# Altium schematic sheet GD32E230C8T6核心板原理图.SchDoc
size A4
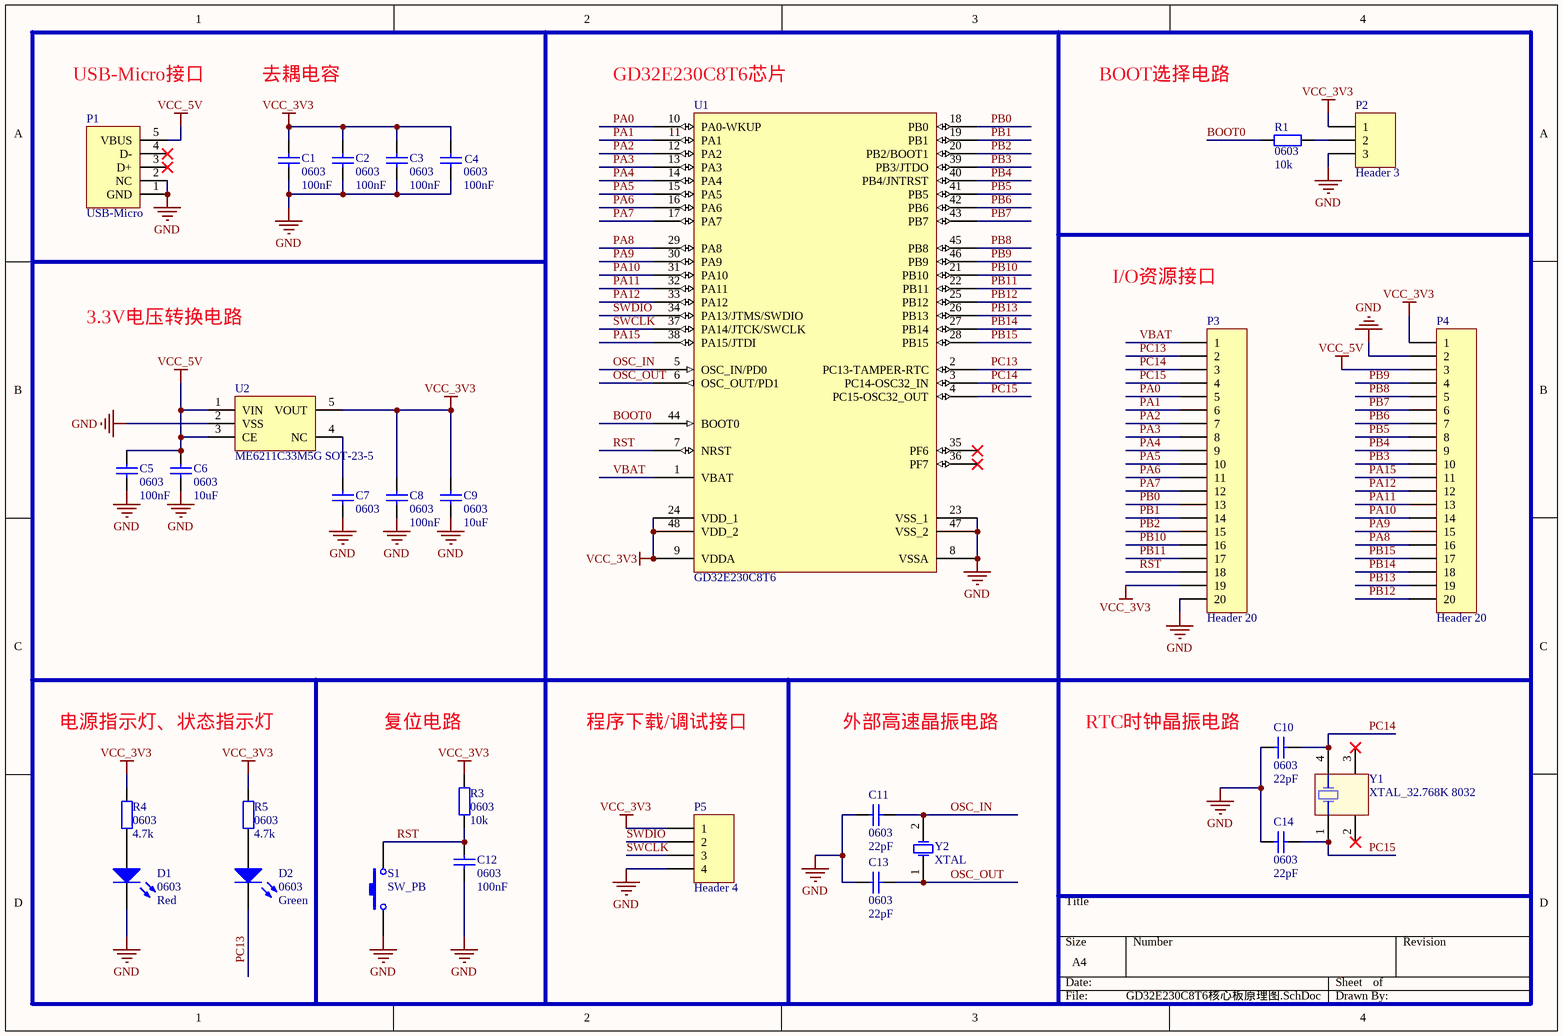
[diagram p0: GD32E230C8T6核心板原理图.SchDoc]

## Parts
C1  value 100nF  footprint: 0603  [R0603-R/C-Y]  (hidden comment: Cap 0603)
C2  value 100nF  footprint: 0603  [R0603-R/C-Y]  (hidden comment: Cap 0603)
C3  value 100nF  footprint: 0603  [R0603-R/C-Y]  (hidden comment: Cap 0603)
C4  value 100nF  footprint: 0603  [R0603-R/C-Y]  (hidden comment: Cap 0603)
C5  value 100nF  footprint: 0603  [R0603-R/C-Y]  (hidden comment: Cap 0603)
C6  value 10uF  footprint: 0603  [R0603-R/C-Y]  (hidden comment: Cap 0603)
C7  footprint: 0603  [R0603-R/C-Y]  (hidden comment: Cap 0603)
C8  value 100nF  footprint: 0603  [R0603-R/C-Y]  (hidden comment: Cap 0603)
C9  value 10uF  footprint: 0603  [R0603-R/C-Y]  (hidden comment: Cap 0603)
C10  value 22pF  footprint: 0603  [R0603-R/C-Y]  (hidden comment: Cap 0603)
C11  value 22pF  footprint: 0603  [R0603-R/C-Y]  (hidden comment: Cap 0603)
C12  value 100nF  footprint: 0603  [R0603-R/C-Y]  (hidden comment: Cap 0603)
C13  value 22pF  footprint: 0603  [R0603-R/C-Y]  (hidden comment: Cap 0603)
C14  value 22pF  footprint: 0603  [R0603-R/C-Y]  (hidden comment: Cap 0603)
D1  value Red  Footprint: 0603  [0603-LED-G]  (hidden comment: LED 0603)
D2  value Green  Footprint: 0603  [0603-LED-G]  (hidden comment: LED 0603)
P1  USB-Micro  [USB Micro]
P2  Header 3  [HDR1X3]
P3  Header 20  [HDR1X20]
P4  Header 20  [HDR1X20]
P5  Header 4  [HDR1X4]
R1  value 10k  Footprint: 0603  [R0603-R/C-BY]  (hidden comment: Res 0603)
R3  value 10k  Footprint: 0603  [R0603-R/C-BY]  (hidden comment: Res 0603)
R4  value 4.7k  Footprint: 0603  [R0603-R/C-BY]  (hidden comment: Res 0603)
R5  value 4.7k  Footprint: 0603  [R0603-R/C-BY]  (hidden comment: Res 0603)
S1  SW_PB  [SW-2Pin]
U1  GD32E230C8T6  [TQFP48_M]
U2  ME6211C33M5G SOT-23-5  [SOT-23-5]
Y1  XTAL_32.768K 8032  [XTAL_8032]
Y2  XTAL  [XTAL_49S]

## Nets
GND: C1.1 C2.1 C3.1 C4.1 C5.1 C6.1 C7.1 C8.1 C9.1 C10.2 C11.2 C12.1 C13.2 C14.2 D1.2(K) P1.1(GND) P1.2(NC) P2.3 P3.20 P4.2 P5.4 S1.1 U1.8(VSSA) U1.23(VSS_1) U1.47(VSS_2) U2.2(VSS)
VCC_3V3: C1.2 C2.2 C3.2 C4.2 C8.2 C9.2 P2.1 P3.19 P4.1 P5.1 R3.2 R4.1 R5.1 U1.9(VDDA) U1.24(VDD_1) U1.48(VDD_2) U2.5(VOUT)
VCC_5V: C5.2 C6.2 P1.5(VBUS) P4.3 U2.1(VIN) U2.3(CE)
BOOT0: R1.1 U1.44(BOOT0)
OSC_IN: C11.1 U1.5(OSC_IN/PD0) Y2.2(OSC2)
OSC_OUT: C13.1 U1.6(OSC_OUT/PD1) Y2.1(OSC1)
PA0: P3.5 U1.10(PA0-WKUP)
PA1: P3.6 U1.11(PA1)
PA2: P3.7 U1.12(PA2)
PA3: P3.8 U1.13(PA3)
PA4: P3.9 U1.14(PA4)
PA5: P3.10 U1.15(PA5)
PA6: P3.11 U1.16(PA6)
PA7: P3.12 U1.17(PA7)
PA8: P4.16 U1.29(PA8)
PA9: P4.15 U1.30(PA9)
PA10: P4.14 U1.31(PA10)
PA11: P4.13 U1.32(PA11)
PA12: P4.12 U1.33(PA12)
PA15: P4.11 U1.38(PA15/JTDI)
PB0: P3.13 U1.18(PB0)
PB1: P3.14 U1.19(PB1)
PB2: P3.15 U1.20(PB2/BOOT1)
PB3: P4.10 U1.39(PB3/JTDO)
PB4: P4.9 U1.40(PB4/JNTRST)
PB5: P4.8 U1.41(PB5)
PB6: P4.7 U1.42(PB6)
PB7: P4.6 U1.43(PB7)
PB8: P4.5 U1.45(PB8)
PB9: P4.4 U1.46(PB9)
PB10: P3.16 U1.21(PB10)
PB11: P3.17 U1.22(PB11)
PB12: P4.20 U1.25(PB12)
PB13: P4.19 U1.26(PB13)
PB14: P4.18 U1.27(PB14)
PB15: P4.17 U1.28(PB15)
PC13: D2.2(K) P3.2 U1.2(PC13-TAMPER-RTC)
PC14: C10.1 P3.3 U1.3(PC14-OSC32_IN) Y1.4(OSC2)
PC15: C14.1 P3.4 U1.4(PC15-OSC32_OUT) Y1.1(OSC1)
RST: C12.2 P3.18 R3.1 S1.2 U1.7(NRST)
SWCLK: P5.3 U1.37(PA14/JTCK/SWCLK)
SWDIO: P5.2 U1.34(PA13/JTMS/SWDIO)
VBAT: P3.1 U1.1(VBAT)
NetC7_2: C7.2 U2.4(NC)
NetD1_1: D1.1(A) R4.2
NetD2_1: D2.1(A) R5.2
NetP2_2: P2.2 R1.2

Not connected (* = marked no-connect by the designer): P1 3(D+)* 4(D-)*; U1 35(PF6)* 36(PF7)*; Y1 2(NC)* 3(NC)*

## Notes on the sheet
- USB-Micro接口
- 去耦电容
- (near U1) GD32E230C8T6芯片
- BOOT选择电路
- I/O资源接口
- 3.3V电压转换电路
- 电源指示灯、状态指示灯
- 复位电路
- 程序下载/调试接口
- 外部高速晶振电路
- RTC时钟晶振电路

## Library data of the parts
C1-C6 C8-C14 = Cap 0603: Capacitor 0603
C7 = Cap 0603: Capacitor 0603; value: 100nF
P2 = Header 3: Header, 3-Pin; LatestRevisionDate: 17-Jul-2002; LatestRevisionNote: Re-released for DXP Platform.; Publisher: Altium Limited
P3 P4 = Header 20: Header, 20-Pin; LatestRevisionDate: 17-Jul-2002; LatestRevisionNote: Re-released for DXP Platform.; Publisher: Altium Limited
P5 = Header 4: Header, 4-Pin; LatestRevisionDate: 17-Jul-2002; LatestRevisionNote: Re-released for DXP Platform.; Publisher: Altium Limited
R1 R3-R5 = Res 0603: Resistor 0603
U1 = STM32F030C8T6: STM32F030C8T6 LQFP48
U2 = ME6211C33M5G
Y2 = XTAL 8MHZ